# Altium schematic sheet Sheet6.SchDoc
size A4
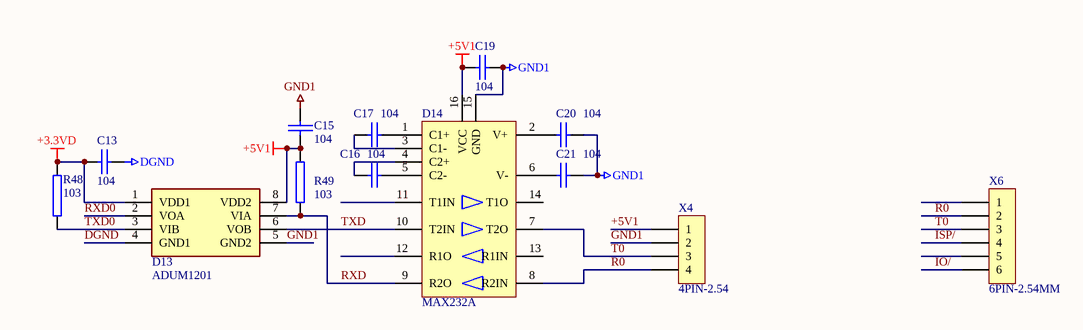
[diagram p0: Sheet6.SchDoc]

## Parts
C13  104  [0603X]
C15  104  [0603X]
C16  104  [0603X]
C17  104  [0603X]
C19  104  [0603X]
C20  104  [0603X]
C21  104  [0603X]
D13  ADUM1201  [SMD8XX]
D14  MAX232A  [SMD16XX]
R48  103  [0603X]
R49  103  [0603X]
X4  4PIN-2.54  [SIP4X]
X6  6PIN-2.54MM  [SIP6X]

## Nets
+3.3VD: C13.1 D13.1(VDD1) R48.2
+5V1: C15.1 C19.2 D13.8(VDD2) D14.16(VCC) R49.2 X4.1
DGND: C13.2 D13.4(GND1)
GND1: C15.2 C19.1 C20.1 C21.1 D13.5(GND2) D14.15(GND) X4.2
IO/: X6.6
ISP/: X6.4
R0: D14.8(R2IN) X4.4 X6.2
RXD: D13.7(VIA) D14.9(R2O) R49.1
RXD0: D13.2(VOA)
T0: D14.7(T2O) X4.3 X6.3
TXD: D13.6(VOB) D14.10(T2IN)
TXD0: D13.3(VIB) R48.1
NetC16_1: C16.1 D14.5(C2-)
NetC16_2: C16.2 D14.4(C2+)
NetC17_1: C17.1 D14.1(C1+)
NetC17_2: C17.2 D14.3(C1-)
NetC20_2: C20.2 D14.2(V+)
NetC21_2: C21.2 D14.6(V-)

Not connected (* = marked no-connect by the designer): D14 11(T1IN) 12(R1O) 13(R1IN) 14(T1O); X6 1 5

## Library data of the parts
C13 C15-C17 C19-C21 = CAP: Capacitor
R48 R49 = RES2
X4 = CON4: Connector
X6 = CON6: Connector